# EAGLE design PCB-Alimentacion (EAGLE 7.2.0)
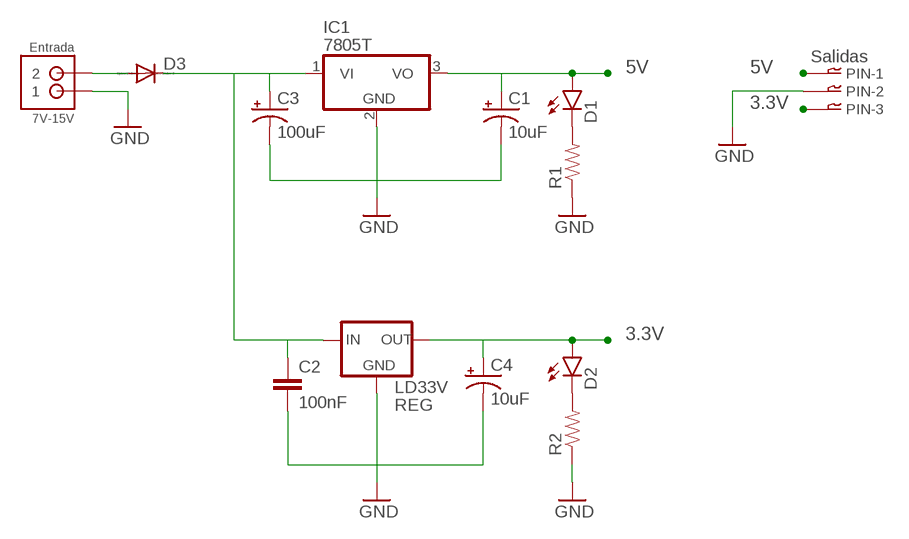
[diagram p0: schematic, sheet 1]

## Parts
7V-15V  Entrada  JST-PH_2-PIN_HEADER  [JST_B2B-PH_HEADER]
C1  10uF  CAP_POLPTH2  [CPOL-RADIAL-10UF-25V]
C2  100nF  CAP_  [AXIAL-5MM]
C3  100uF  CAP_POLPTH2  [CPOL-RADIAL-10UF-25V]
C4  10uF  CAP_POLPTH2  [CPOL-RADIAL-10UF-25V]
D1  LED3MM  [LED3MM]
D2  LED3MM  [LED3MM]
D3  DIODE-DO-214AC  [DO-214AC]
IC1  7805T  [TO220H]
LD33V  REG  V_REG_LD1117VXX  [78XXL]
PIN  Salidas  03-JST-B3B-XH-A  [B3B-XH]
R1  RESISTORKIT  [AXIAL-0.3-KIT]
R2  RESISTORKIT  [AXIAL-0.3-KIT]

## Nets
3.3V: C4.1(+) D2.A LD33V.GND(OUT) PIN.P$3
5V: C1.1(+) D1.A IC1.3(VO) PIN.P$1
GND: 7V-15V.P1 C1.2(-) C2.P$2 C3.2(-) C4.2(-) IC1.2(GND) LD33V.IN(GND) PIN.P$2 R1.P$1 R2.P$1
N$1: C2.P$1 C3.1(+) D3.C IC1.1(VI) LD33V.OUT(IN)
N$2: D1.K(C) R1.P$2
N$3: 7V-15V.P2 D3.A
N$4: D2.K(C) R2.P$2

## Library data of the parts
7V-15V = SRG:JST-PH_2-PIN_HEADER: 2-pin JST PH Shrouded Header, top entry P/N B2B-PH-K-S Mating connector PHR-2 Mating cable assembly: Sparkfun PRT-09914 <http://www.sparkfun.com/products/9914>
C1 C3 C4 = SparkFun-Passives:CAP_POL: Capacitor Polarized These are standard SMD and PTH capacitors. Normally 10uF, 47uF, and 100uF in electrolytic and tantalum varieties. Always verify the external diameter of the through hole cap, it varies with capacity, voltage, and manufacturer. The EIA devices should be standard.
C2 = SparkFun-Passives:CAP: Capacitor Standard 0603 ceramic capacitor, and 0.1" leaded capacitor.
D1 D2 = SparkFun-LED:LED: LEDs Standard schematic elements and footprints for 5mm, 3mm, 1206, and 0603 sized LEDs. 5mm - Spark Fun Electronics SKU : COM-00529 (and others)
D3 = diode 3:DIODE-: DIODE
IC1 = linear:78*: Positive VOLTAGE REGULATOR Source: http://cache.national.com/ds/LM/LM78L05.pdf http://www.fairchildsemi.com/ds/LM/LM7805.pdf
LD33V = SparkFun-PowerIC:V_REG_LD1117VXX: LD1117VXX voltage regulator. We carry the 3.3V version (COM-00526) in TO-220 package.
PIN = bt_con-jst-xh:03-JST: JST CONNECTOR
R1 R2 = SparkFun-Passives:RESISTOR: Resistor Basic schematic elements and footprints for 0603, 1206, and PTH resistors.

## Board
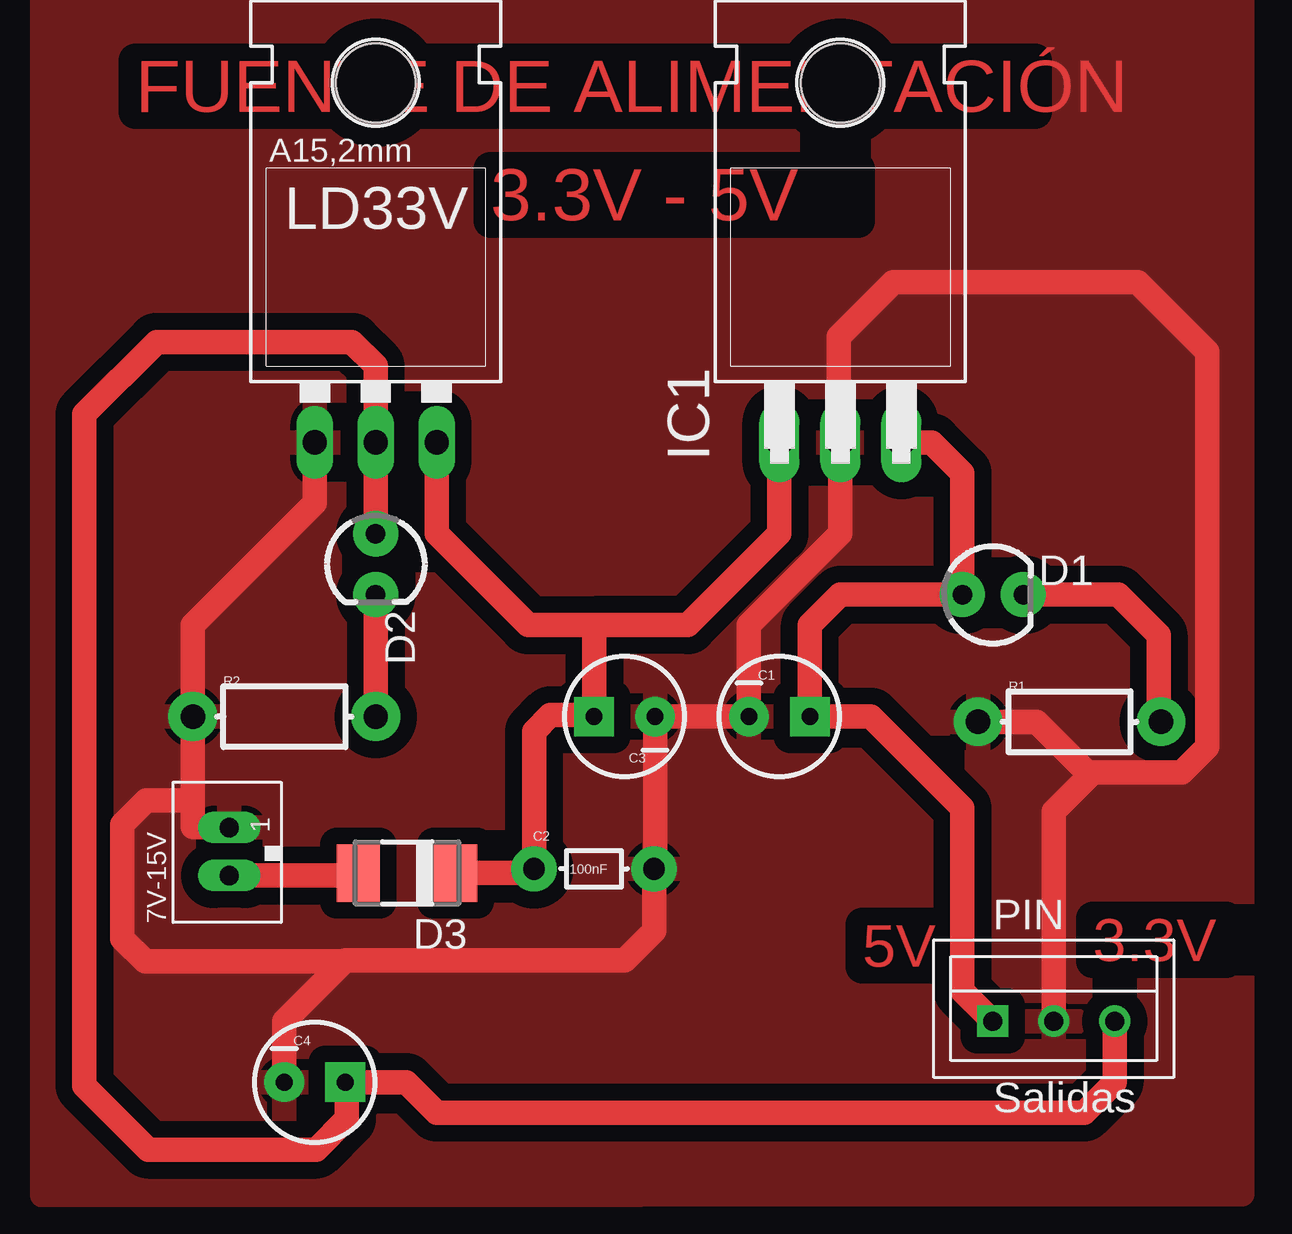
[diagram p1: board, top side]

No outline drawn. Coordinates in mm, seen from the top.
Copper layers (1*16): Top 0.035mm / dielectric 1.5mm / Bottom 0.035mm
Design rules "default": minimum track width 10mil, minimum drill 24mil, track to track 8mil, track to pad 8mil, pad to pad 8mil, via to via 8mil, smd to smd 8mil, copper to edge 40mil, drill to drill 8mil, minimum pad ring 10mil, minimum via ring 8mil, stop-mask expansion 4mil, vias tented up to drill 0mil, thermal gap 10mil

### Footprints (pad centres in the part's own frame; a part is rotated, then mirrored left to right if it is on the bottom)
JST_B2B-PH_HEADER = drill 0.8 long: P1 1.075,0.048; P2 -0.925,0.048
CPOL-RADIAL-10UF-25V = drill 0.7 pad 1.651 square: 1 1.27,0 | drill 0.7 pad 1.651: 2 -1.27,0
AXIAL-5MM = drill 0.9 pad 1.88: P$1 -2.5,0; P$2 2.5,0
LED3MM = drill 0.813 pad 1.88: A -1.27,0; K 1.27,0
DO-214AC = smd 1.8 x 2.4: A 2.025,0; C -2.025,0
TO220H = drill 1.118 long: 1 -2.54,-10.16; 2 0,-10.16; 3 2.54,-10.16 | hole 3.302: 0,4.826
78XXL = drill 1.016 long: GND 0,-3.81; IN -2.54,-3.81; OUT 2.54,-3.81 | hole 3.302: 0,11.176
B3B-XH = drill 0.8 square: P$1 -2.54,0 | drill 0.8: P$2 0,0; P$3 2.54,0
AXIAL-0.3-KIT = drill 1.016 pad 2.032: P$1 -3.81,0; P$2 3.81,0

### Placement (x,y rotation side)
7V-15V  7.83,14.2 90 top
C1  30.71,19.91 0 top
C2  22.98,13.56 0 top
C3  24.25,19.91 180 top
C4  11.35,4.67 0 top
D1  39.6,24.99 0 top
D2  13.89,26.26 270 top
D3  15.19,13.39 180 top
IC1  33.25,41.5 0 top
LD33V  13.89,35.15 0 top
PIN  42.14,7.21 0 top
R1  42.79,19.69 0 top
R2  10.08,19.91 0 top

### Tracks (layer width: path | path; a pad name or v marks a point on that pad's centre or on a via)
3.3V
  Top 1.016: PIN.P$3 44.68,4.67 43.41,3.4 16.43,3.4 15.16,4.67 C4.1 12.69,4.6 12.69,3.14 11.41,1.86 4.41,1.86 1.75,4.52 1.75,32.51 4.75,35.52 12.9,35.52 13.89,34.53 D2.A LD33V.GND
5V
  Top 1.016: IC1.3 37.06,31.34 38.33,30.07 D1.A 33.25,24.99 31.98,23.72 C1.1 34.52,19.91 38.33,16.1 38.33,8.48 PIN.P$1
GND
  Top 1.016: 12.57,9.71 10.08,7.21 C4.2 | LD33V.IN 11.35,28.8 6.27,23.72 R2.P$1 6.27,16.41 | 7V-15V.P1 7.74,15.32 6.26,15.32 6.27,15.32 6.27,16.41 | 12.57,9.71 12.62,9.75 24.25,9.75 25.48,10.98 C2.P$2 25.52,13.6 C3.2 C1.2 29.44,23.72 33.25,27.53 IC1.2 33.17,31.41 33.17,35.73 35.44,38.01 45.64,38.01 48.53,35.12 48.53,18.64 47.46,17.57 43.77,17.57 | 12.57,9.71 4.27,9.71 3.33,10.65 3.33,15.41 4.32,16.41 6.27,16.41 | R1.P$1 41.42,19.69 43.54,17.57 43.77,17.57 | PIN.P$2 42.14,15.95 43.77,17.57
  pour Top (isolate 0.7): 0,-0.04 0,50 50,50 50,0
N$1
  Top 1.016: IC1.1 30.71,27.53 26.9,23.72 22.98,23.72 | 22.98,23.72 C3.1 22.93,19.96 21.16,19.96 20.48,19.28 C2.P$1 20.31,13.39 D3.C | LD33V.OUT 16.43,27.53 20.24,23.72 22.98,23.72
N$2
  Top 1.016: D1.K 44.83,24.99 46.51,23.31 46.51,19.78 R1.P$2
N$3
  Top 1.016: 7V-15V.P2 13.05,13.28 D3.A
N$4
  Top 1.016: D2.K R2.P$2

### Text on the board
Top: FUENTE DE ALIMENTACIÓN | 3.3V - 5V | 3.3V | 5V